# EAGLE design Wiciński (EAGLE 7.7.0)
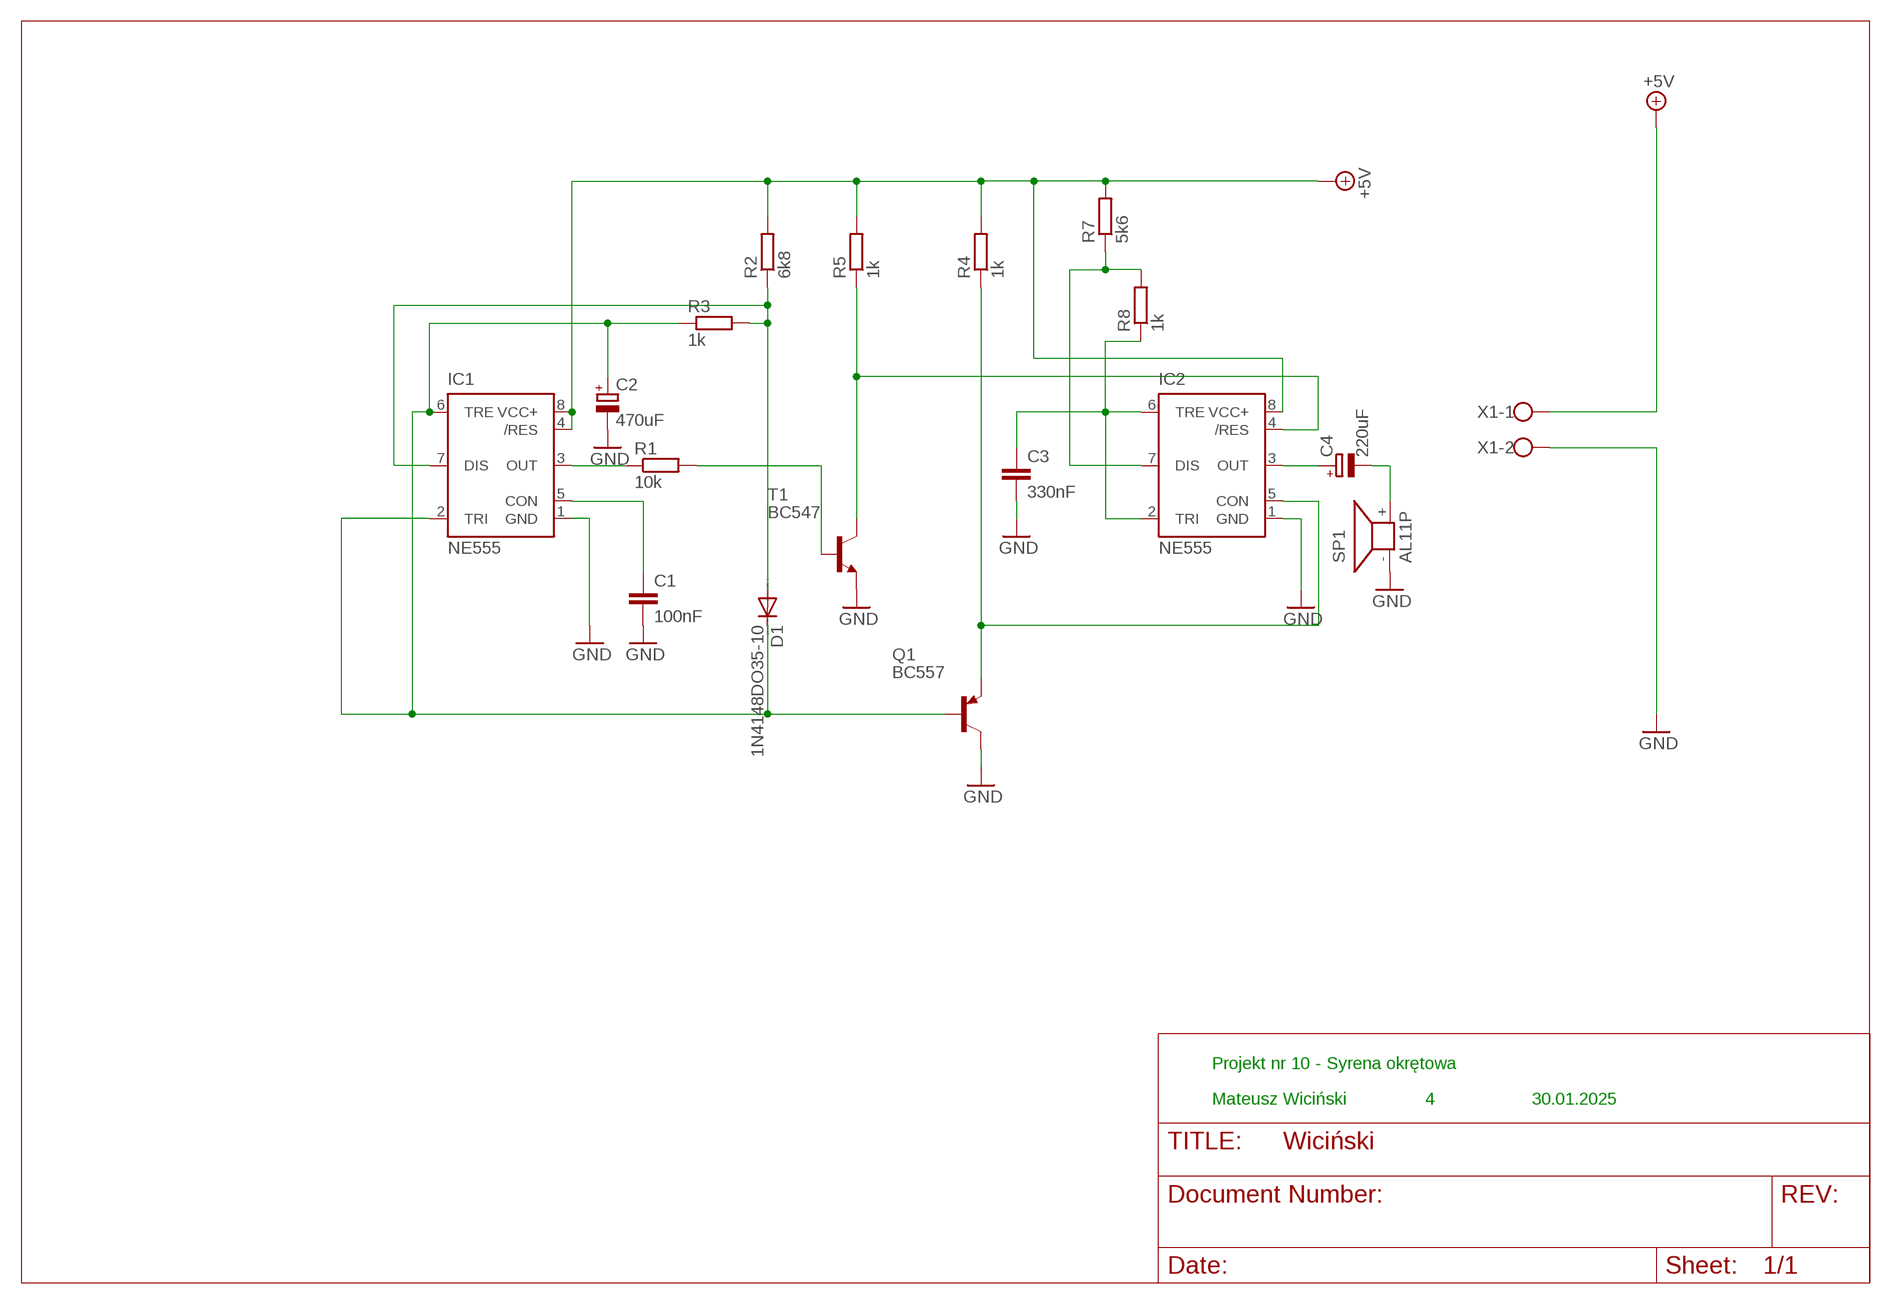
[diagram p0: schematic, sheet 1]

## Parts
C1  100nF  C-EU050-050X075  [C050-050X075]
C2  470uF  CPOL-EU140CLH-1014  [140CLH-1014]
C3  330nF  C-EU050-050X075  [C050-050X075]
C4  220uF  CPOL-EU140CLH-1014  [140CLH-1014]
D1  1N4148DO35-10  [DO35-10]
IC1  NE555  [DIL-08]
IC2  NE555  [DIL-08]
Q1  BC557  [TO92]
R1  10k  R-EU_0207/10  [0207/10]
R2  6k8  R-EU_0207/10  [0207/10]
R3  1k  R-EU_0207/10  [0207/10]
R4  1k  R-EU_0207/10  [0207/10]
R5  1k  R-EU_0207/10  [0207/10]
R7  5k6  R-EU_0207/10  [0207/10]
R8  1k  R-EU_0207/10  [0207/10]
SP1  AL11P  [AL11P]
T1  BC547  [TO92]
X1  W237-102  [W237-102]

## Nets
+5V: IC1.4(/RES) IC1.8(VCC+) IC2.8(VCC+) R2.2 R4.2 R5.2 R7.2 X1.1
GND: C1.2 C2.- C3.2 IC1.1(GND) IC2.1(GND) Q1.3(C) SP1.- T1.1(E) X1.2
N$1: IC1.3(OUT) R1.1
N$2: C2.+ D1.C IC1.2(TRI) IC1.6(TRE) Q1.2(B) R3.1
N$3: C1.1 IC1.5(CON)
N$6: D1.A IC1.7(DIS) R2.1 R3.2
N$7: R1.2 T1.2(B)
N$8: C4.+ IC2.3(OUT)
N$9: IC2.5(CON) Q1.1(E) R4.1
N$10: C4.- SP1.+
N$11: IC2.4(/RES) R5.1 T1.3(C)
N$12: IC2.7(DIS) R7.1 R8.2
N$14: C3.1 IC2.2(TRI) IC2.6(TRE) R8.1

## Notes on the sheet
- Projekt nr 10 - Syrena okrętowa
- Mateusz Wiciński | 4 | 30.01.2025

## Library data of the parts
C1 C3 = rcl:C-EU: CAPACITOR, European symbol
C2 C4 = rcl:CPOL-EU: POLARIZED CAPACITOR, European symbol
D1 = diode:1N4148: DIODE high speed (Philips)
IC1 IC2 = st-microelectronics:NE555: General purpose bipolar Timer; MF: Arrow Electronics; MPN: NE555N; OC_FARNELL: 1467742; OC_NEWARK: 89K1486
Q1 = transistor-pnp:BC557: PNP Transistor
R1-R5 R7 R8 = rcl:R-EU_: RESISTOR, European symbol
SP1 = buzzer:AL11P: SPEAKER Source: Buerklin; OC_FARNELL: unknown; OC_NEWARK: unknown
T1 = transistor-neu-to92:BC547: NPN TRANSISTOR
X1 = con-wago-500:W237-102: WAGO SCREW CLAMP; MPN: 237-102; OC_FARNELL: unknown; OC_NEWARK: 70K9898

## Board
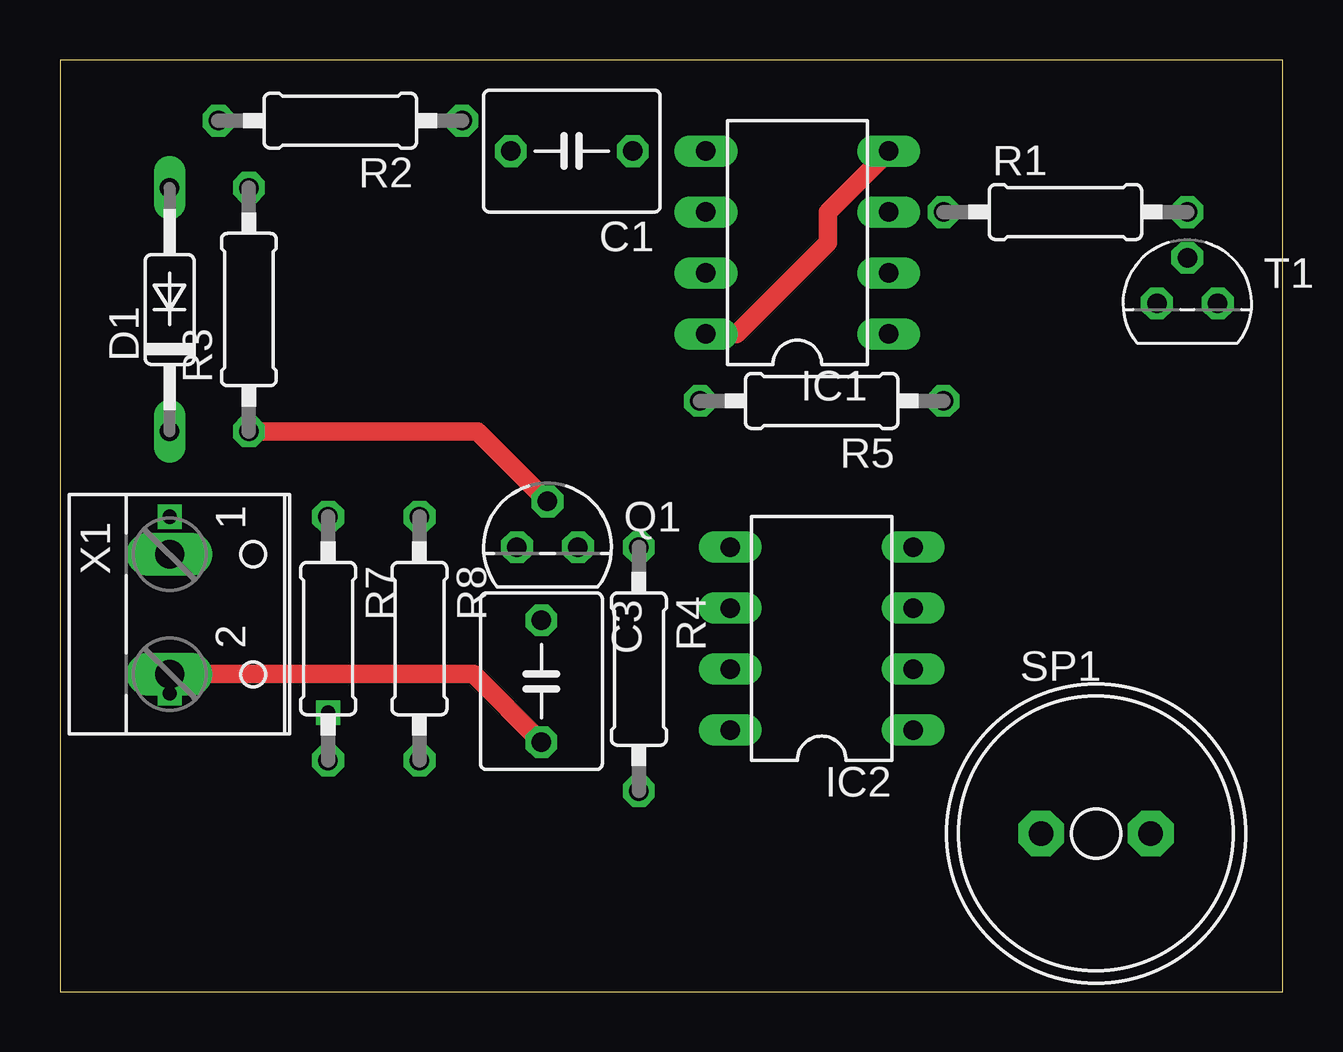
[diagram p1: board, top side]
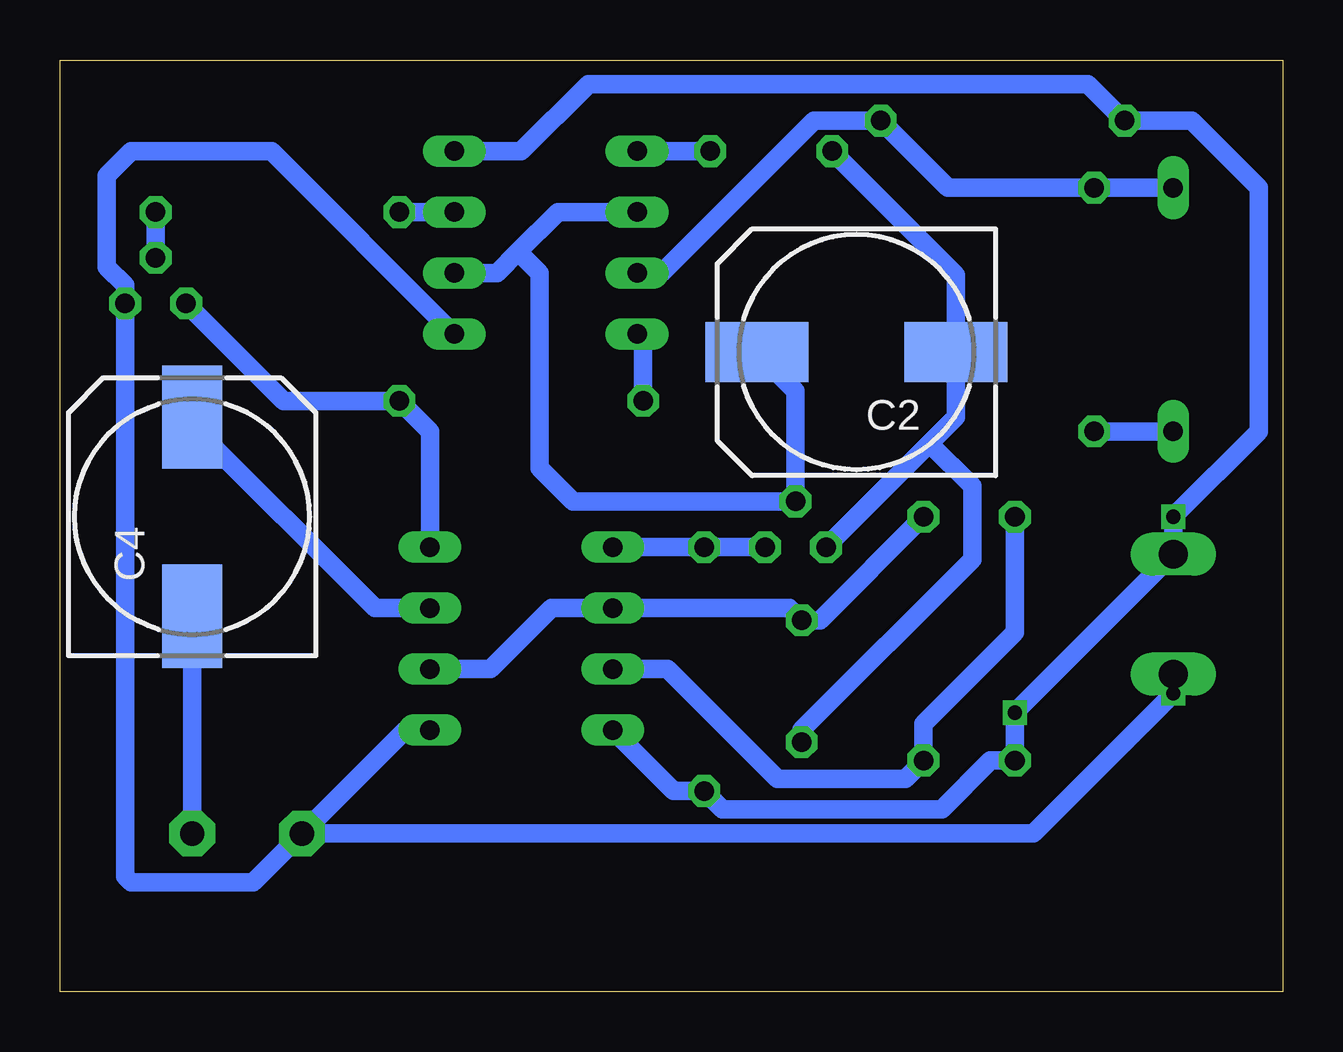
[diagram p2: board, bottom side, seen from below]

Size 50.98 x 38.85 mm. Coordinates in mm from the lower left corner, seen from the top.
Outline: 0,0 50.98,0 50.98,38.85 0,38.85 0,0
Copper layers (1*16): Top 0.035mm / dielectric 1.5mm / Bottom 0.035mm
Design rules "default": minimum track width 10mil, minimum drill 24mil, track to track 8mil, track to pad 8mil, pad to pad 8mil, via to via 8mil, smd to smd 8mil, copper to edge 40mil, drill to drill 8mil, minimum pad ring 10mil, minimum via ring 8mil, stop-mask expansion 4mil, vias tented up to drill 0mil, thermal gap 10mil

### Footprints (pad centres in the part's own frame; a part is rotated, then mirrored left to right if it is on the bottom)
C050-050X075 = drill 0.813 octagon: 1 -2.54,0; 2 2.54,0
140CLH-1014 = smd 4.3 x 2.5: + 4.15,0; - -4.15,0
DO35-10 = drill 0.813 long: A 5.08,0; C -5.08,0
DIL-08 = drill 0.813 long: 1 -3.81,-3.81; 2 -1.27,-3.81; 3 1.27,-3.81; 4 3.81,-3.81; 5 3.81,3.81; 6 1.27,3.81; 7 -1.27,3.81; 8 -3.81,3.81
TO92 = drill 0.813 octagon: 1 1.27,0; 2 0,1.905; 3 -1.27,0
0207/10 = drill 0.813 octagon: 1 -5.08,0; 2 5.08,0
AL11P = drill 1.016 pad 1.905 octagon: + 2.286,0; - -2.286,0
W237-102 = drill 1.194 long: 1 -2.5,-1.27; 2 2.5,-1.27

### Placement (x,y rotation side)
C1  21.34,35.05 180 top
C2  17.78,26.67 180 bottom
C3  20.07,12.95 270 top
C4  45.47,19.81 90 bottom
D1  4.57,28.45 90 top
IC1  30.73,31.24 90 top
IC2  31.75,14.73 90 top
Q1  20.32,18.54 0 top
R1  41.91,32.51 0 top
R2  11.68,36.32 180 top
R3  7.87,28.45 90 top
R4  24.13,13.46 270 top
R5  31.75,24.64 180 top
R7  11.18,14.73 270 top
R8  14.99,14.73 270 top
SP1  43.18,6.6 0 top
T1  46.99,28.7 0 top
X1  5.84,15.75 270 top

### Tracks (layer width: path | path; a pad name or v marks a point on that pad's centre or on a via)
+5V  (via drill 0.6)
  Top 0.762: IC1.8 28.19,27.43 32,31.24 32,32.51 IC1.4
  Bottom 0.762: IC2.8 25.4,8.38 R4.2 23.37,7.62 14.22,7.62 12.19,9.65 R7.2 v11.18,11.64 X1.1 v4.57,19.81 1.02,23.37 1.02,33.53 3.81,36.32 R2.2 8.13,37.85 28.96,37.85 31.75,35.05 IC1.4 | R5.2 26.67,27.18 IC1.8
GND  (via drill 0.6)
  Top 0.762: X1.2 17.23,13.25 C3.2
  Bottom 0.762: IC2.1 36.58,10.92 SP1.- | SP1.- 42.93,4.57 48.01,4.57 48.26,4.83 T1.1 48.26,29.46 49.02,30.23 49.02,34.04 48.01,35.05 42.16,35.05 IC1.1 | 14.73,22.86 13.63,23.96 C2.- 13.63,29.89 C1.2 | 14.73,22.86 Q1.3 | C3.2 20.07,10.92 12.95,18.03 12.95,21.08 14.73,22.86 | X1.2 v4.57,12.45 10.41,6.6 SP1.-
N$1
  Bottom 0.762: IC1.3 R1.1
N$2
  Top 0.762: R3.1 17.4,23.37 Q1.2
  Bottom 0.762: C2.+ 20.32,25.06 Q1.2 29.59,20.45 30.99,21.84 30.99,29.97 31.88,30.86 | IC1.2 32.77,29.97 31.88,30.86 | 31.88,30.86 30.23,32.51 IC1.6 | D1.C R3.1
N$3
  Bottom 0.762: C1.1 IC1.5
N$6
  Bottom 0.762: IC1.7 25.91,29.97 19.56,36.32 R2.1 13.97,33.53 R3.2 D1.A
N$7
  Bottom 0.762: R1.2 T1.2
N$8
  Bottom 0.762: C4.+ 45.47,23.62 37.85,16 IC2.3
N$9
  Bottom 0.762: IC2.5 R4.1 Q1.1
N$10
  Bottom 0.762: SP1.+ C4.-
N$11
  Bottom 0.762: IC2.4 35.56,23.37 R5.1 41.66,24.64 T1.3
N$12
  Bottom 0.762: IC2.7 25.65,13.46 21.08,8.89 15.75,8.89 R8.2 14.99,11.18 11.18,14.99 R7.1
N$14
  Bottom 0.762: IC2.2 33.02,13.46 30.48,16 IC2.6 20.57,16 C3.1 19.3,15.49 R8.1